# EAGLE design Driver (EAGLE 9.6.2)
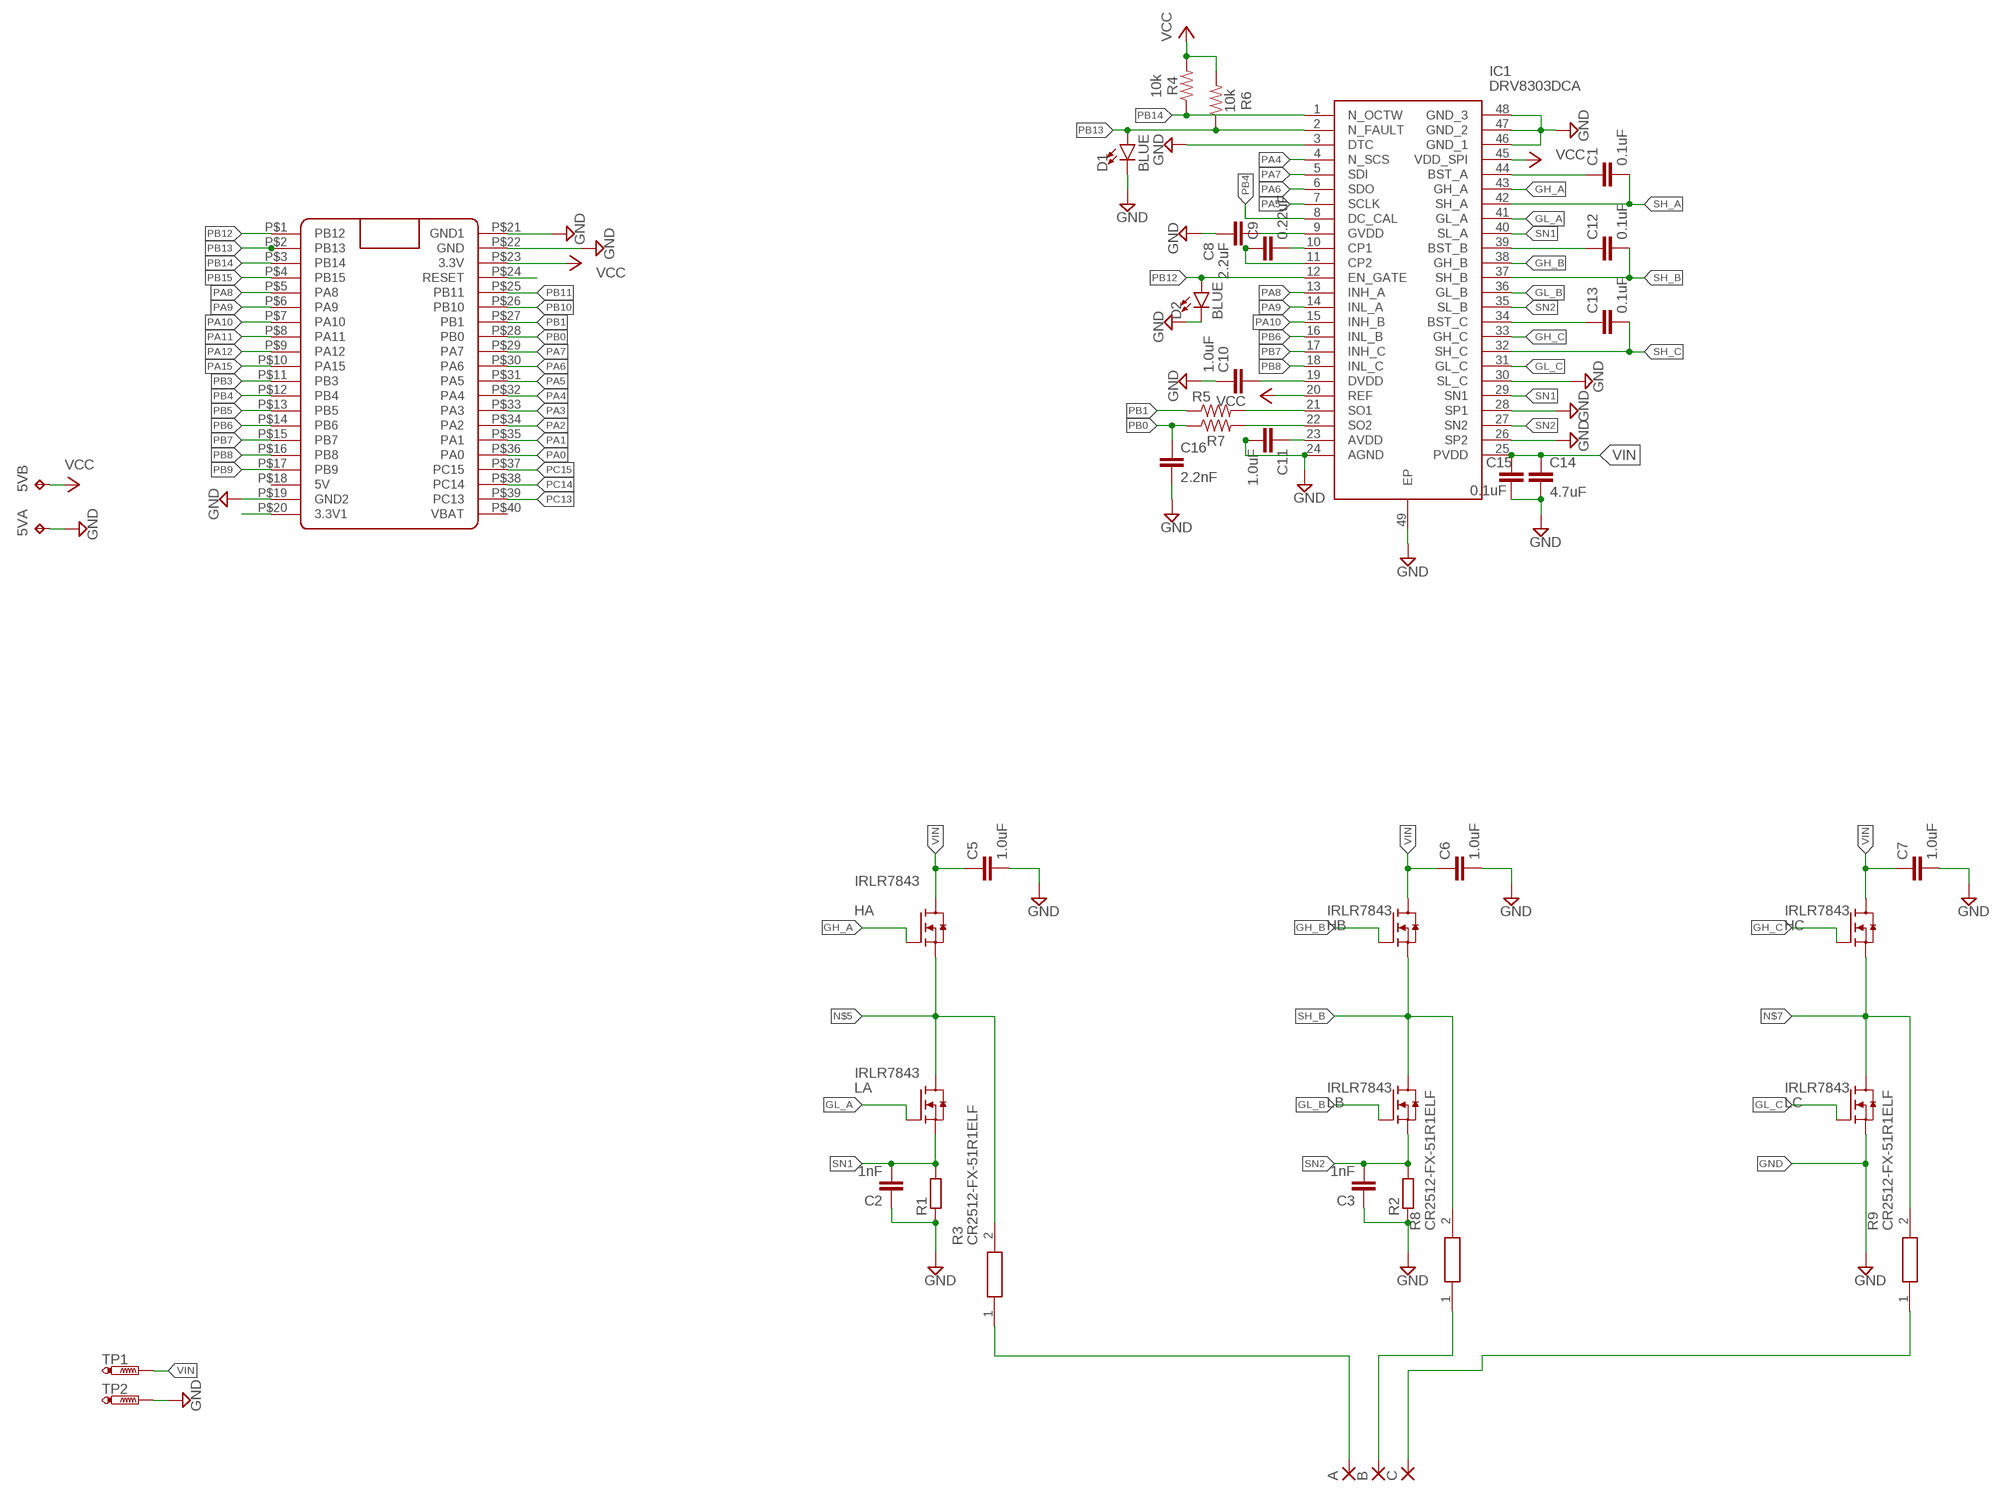
[diagram p0: schematic, sheet 1]

## Parts
5V  TP2P2-38-17  [P2-38-17]
A  SMD5  [SMD2,54-5,08]
B  SMD5  [SMD2,54-5,08]
C  SMD5  [SMD2,54-5,08]
C1  0.1uF  0.1UF-0603-25V-(+80/-20%)  [0603]
C2  1nF  1.0NF/1000PF-0603-50V-10%  [0603]
C3  1nF  1.0NF/1000PF-0603-50V-10%  [0603]
C5  1.0uF  1.0UF-0603-16V-10%-X7R  [0603]
C6  1.0uF  1.0UF-0603-16V-10%-X7R  [0603]
C7  1.0uF  1.0UF-0603-16V-10%-X7R  [0603]
C8  2.2uF  2.2UF-0603-10V-20%  [0603]
C9  0.22uF  0.22UF-0603-25V-10%  [0603]
C10  1.0uF  1.0UF-0603-16V-10%  [0603]
C11  1.0uF  1.0UF-0603-16V-10%  [0603]
C12  0.1uF  0.1UF-0603-25V-(+80/-20%)  [0603]
C13  0.1uF  0.1UF-0603-25V-(+80/-20%)  [0603]
C14  4.7uF  4.7UF-0603-35V-(20%)  [0603]
C15  0.1uF  0.1UF-0603-25V-(+80/-20%)  [0603]
C16  2.2nF  2.2NF/2200PF-0603-50V-10%  [0603]
D1  BLUE  LED-BLUE0603  [LED-0603]
D2  BLUE  LED-BLUE0603  [LED-0603]
HA  IRLR7843  [TO252]
HB  IRLR7843  [TO252]
HC  IRLR7843  [TO252]
IC1  DRV8303DCA  [SOP50P810X120-49N]
LA  IRLR7843  [TO252]
LB  IRLR7843  [TO252]
LC  IRLR7843  [TO252]
R1  R-EU_R2512  [R2512]
R2  R-EU_R2512  [R2512]
R3  CR2512-FX-51R1ELF  [RESC6331X75N]
R4  10k  10KOHM-0603-1/10W-1%  [0603]
R5  0  0OHM-0603-1/10W  [0603]
R6  10k  10KOHM-0603-1/10W-1%  [0603]
R7  0  0OHM-0603-1/10W  [0603]
R8  CR2512-FX-51R1ELF  [RESC6331X75N]
R9  CR2512-FX-51R1ELF  [RESC6331X75N]
TP1  PTR1PAD1-20Y  [P1-20Y]
TP2  PTR1PAD1-20Y  [P1-20Y]
U$1  BLUE_PILLADVANCED  [BLUE_PILL_ADV]

## Nets
GH_A: HA.1(G) IC1.43(GH_A)
GH_B: HB.1(G) IC1.38(GH_B)
GH_C: HC.1(G) IC1.33(GH_C)
GL_A: IC1.41(GL_A) LA.1(G)
GL_B: IC1.36(GL_B) LB.1(G)
GL_C: IC1.31(GL_C) LC.1(G)
GND: 5V.TP-1 C2.1 C3.1 C5.2 C6.2 C7.2 C8.2 C10.1 C11.2 C14.2 C15.2 C16.2 D1.C D2.C IC1.3(DTC) IC1.24(AGND) IC1.26(SP2) IC1.28(SP1) IC1.30(SL_C) IC1.46(GND_1) IC1.47(GND_2) IC1.48(GND_3) IC1.49(EP) LC.2(S) R1.1 R2.1 TP2.TP U$1.P$19(GND2) U$1.P$21(GND1) U$1.P$22(GND)
N$1: IC1.21(SO1) R5.2
N$2: C1.1 IC1.44(BST_A)
N$3: IC1.22(SO2) R7.2
N$4: U$1.P$24(RESET)
N$5: HA.2(S) LA.3(D) R3.2
N$6: B.1(P) R8.1
N$7: HC.2(S) LC.3(D) R9.2
N$9: C12.1 IC1.39(BST_B)
N$14: C13.1 IC1.34(BST_C)
N$32: C8.1 IC1.9(GVDD)
N$33: C9.2 IC1.10(CP1)
N$34: C9.1 IC1.11(CP2)
N$40: U$1.P$20(3.3V1)
N$43: C10.2 IC1.19(DVDD)
N$47: C11.1 IC1.23(AVDD)
PA0: U$1.P$36(PA0)
PA1: U$1.P$35(PA1)
PA2: U$1.P$34(PA2)
PA3: U$1.P$33(PA3)
PA4: IC1.4(N_SCS) U$1.P$32(PA4)
PA5: IC1.7(SCLK) U$1.P$31(PA5)
PA6: IC1.6(SDO) U$1.P$30(PA6)
PA7: IC1.5(SDI) U$1.P$29(PA7)
PA8: IC1.13(INH_A) U$1.P$5(PA8)
PA9: IC1.14(INL_A) U$1.P$6(PA9)
PA10: IC1.15(INH_B) U$1.P$7(PA10)
PA11: U$1.P$8(PA11)
PA12: U$1.P$9(PA12)
PA15: U$1.P$10(PA15)
PB0: C16.1 R7.1 U$1.P$28(PB0)
PB1: R5.1 U$1.P$27(PB1)
PB3: U$1.P$11(PB3)
PB4: IC1.8(DC_CAL) U$1.P$12(PB4)
PB5: U$1.P$13(PB5)
PB6: IC1.16(INL_B) U$1.P$14(PB6)
PB7: IC1.17(INH_C) U$1.P$15(PB7)
PB8: IC1.18(INL_C) U$1.P$16(PB8)
PB9: U$1.P$17(PB9)
PB10: U$1.P$26(PB10)
PB11: U$1.P$25(PB11)
PB12: D2.A IC1.12(EN_GATE) U$1.P$1(PB12)
PB13: D1.A IC1.2(N_FAULT) R6.1 U$1.P$2(PB13)
PB14: IC1.1(N_OCTW) R4.1 U$1.P$3(PB14)
PB15: U$1.P$4(PB15)
PC13: U$1.P$39(PC13)
PC14: U$1.P$38(PC14)
PC15: U$1.P$37(PC15)
SH_A: A.1(P) C1.2 IC1.42(SH_A) R3.1
SH_B: C12.2 HB.2(S) IC1.37(SH_B) LB.3(D) R8.2
SH_C: C13.2 C.1(P) IC1.32(SH_C) R9.1
SN1: C2.2 IC1.29(SN1) IC1.40(SL_A) LA.2(S) R1.2
SN2: C3.2 IC1.27(SN2) IC1.35(SL_B) LB.2(S) R2.2
VCC: 5V.TP-2 IC1.20(REF) IC1.45(VDD_SPI) R4.2 R6.2 U$1.P$23(3.3V)
VIN: C5.1 C6.1 C7.1 C14.1 C15.1 HA.3(D) HB.3(D) HC.3(D) IC1.25(PVDD) TP1.TP
Unconnected: U$1.P$18(5V) U$1.P$40(VBAT)

## Library data of the parts
5V = testpad:TP2: Test pad
A B C = wirepad:SMD5: SMD PAD
C1 C12 C13 C15 = SparkFun-Capacitors:0.1UF: 0.1µF ceramic capacitors A capacitor is a passive two-terminal electrical component used to store electrical energy temporarily in an electric field.; PROD_ID: CAP-00810
C2 C3 = SparkFun-Capacitors:1.0NF/1000PF: 1nF/1,000pF ceramic capacitors A capacitor is a passive two-terminal electrical component used to store electrical energy temporarily in an electric field.; PROD_ID: CAP-07886
C5-C7 = SparkFun-Capacitors:1.0UF: 1µF ceramic capacitors A capacitor is a passive two-terminal electrical component used to store electrical energy temporarily in an electric field.; PROD_ID: CAP-13930
C8 = SparkFun-Capacitors:2.2UF: 2.2µF ceramic capacitors A capacitor is a passive two-terminal electrical component used to store electrical energy temporarily in an electric field.; PROD_ID: CAP-07888
C9 = SparkFun-Capacitors:0.22UF: 0.22µF ceramic capacitors A capacitor is a passive two-terminal electrical component used to store electrical energy temporarily in an electric field.; PROD_ID: CAP-07822
C10 C11 = SparkFun-Capacitors:1.0UF: 1µF ceramic capacitors A capacitor is a passive two-terminal electrical component used to store electrical energy temporarily in an electric field.; PROD_ID: CAP-00868
C14 = SparkFun-Capacitors:4.7UF: 4.7µF ceramic capacitors A capacitor is a passive two-terminal electrical component used to store electrical energy temporarily in an electric field.; PROD_ID: CAP-14106
C16 = SparkFun-Capacitors:2.2NF/2200PF: 2.2nF/2,200pF ceramic capacitors A capacitor is a passive two-terminal electrical component used to store electrical energy temporarily in an electric field.; PROD_ID: CAP-07877
D1 D2 = SparkFun-LED:LED-BLUE: Blue SMD LED Used in manufacturing of various products at SparkFun Packages: 0603 - SMD 0603 package [Product Link] <http://www.digikey.com/product-detail/en/SMLE12BC7TT86/511-1589-2-ND/1641808> 1206 - SMD1206 package [Product Link] <http://www.digikey.com/product-detail/en/lite-on-inc/LTST-C150TBKT/160-1643-1-ND/573584> SparkFun Products: ESP8266 Thing-Dev Board <https://www.sparkfun.com/products/13711> RedBoard <https://www.sparkfun.com/products/12757>; PROD_ID: DIO-08575
HA HB HC LA LB LC = BLDC project:IRLR7843
IC1 = DRV8303DCA:DRV8303DCA: Texas Instruments DRV8303DCA, Three-Phase Gate Driver With Dual-Current Shunt Source: Datasheet <https://componentsearchengine.com/Datasheets/2/DRV8303DCA.pdf>; ARROW_PART_NUMBER: DRV8303DCA; ARROW_PRICE-STOCK: https://www.arrow.com/en/products/drv8303dca/texas-instruments; DESCRIPTION: Texas Instruments DRV8303DCA, Three-Phase Gate Driver With Dual-Current Shunt; HEIGHT: 1.2mm; MANUFACTURER_NAME: Texas Instruments; MANUFACTURER_PART_NUMBER: DRV8303DCA; MOUSER_PART_NUMBER: 595-DRV8303DCA; MOUSER_PRICE-STOCK: https://www.mouser.co.uk/ProductDetail/Texas-Instruments/DRV8303DCA?qs=igp4D3uu33KLowzNFy6WPA%3D%3D
R1 R2 = rcl:R-EU_: RESISTOR, European symbol; SPICEPREFIX: R
R3 R8 R9 = CR2512-FX-51R1ELF:CR2512-FX-51R1ELF: BOURNS - CR2512-FX-51R1ELF - RES 2512 51R1 1% 1W TC100 28X7511 Source: Datasheet <http://componentsearchengine.com/Datasheets/2/CR2512-FX-51R1ELF.pdf>; ARROW_PART_NUMBER: CR2512-FX-51R1ELF; ARROW_PRICE-STOCK: https://www.arrow.com/en/products/cr2512-fx-51r1elf/bourns; DESCRIPTION: BOURNS - CR2512-FX-51R1ELF - RES 2512 51R1 1% 1W TC100 28X7511; HEIGHT: 0.75mm; MANUFACTURER_NAME: Bourns; MANUFACTURER_PART_NUMBER: CR2512-FX-51R1ELF; MOUSER_PART_NUMBER: 652-CR2512FX51R1ELF; MOUSER_PRICE-STOCK: https://www.mouser.com/Search/Refine.aspx?Keyword=652-CR2512FX51R1ELF
R4 R6 = SparkFun-Resistors:10KOHM: 10kΩ resistor A resistor is a passive two-terminal electrical component that implements electrical resistance as a circuit element. Resistors act to reduce current flow, and, at the same time, act to lower voltage levels within circuits. - Wikipedia; PROD_ID: RES-00824
R5 R7 = SparkFun-Resistors:0OHM: 0Ω resistor A resistor is a passive two-terminal electrical component that implements electrical resistance as a circuit element. Resistors act to reduce current flow, and, at the same time, act to lower voltage levels within circuits. - Wikipedia; PROD_ID: RES-08609
TP1 TP2 = testpad:PTR1: TEST PIN
U$1 = BluePill:BLUE_PILL

## Board
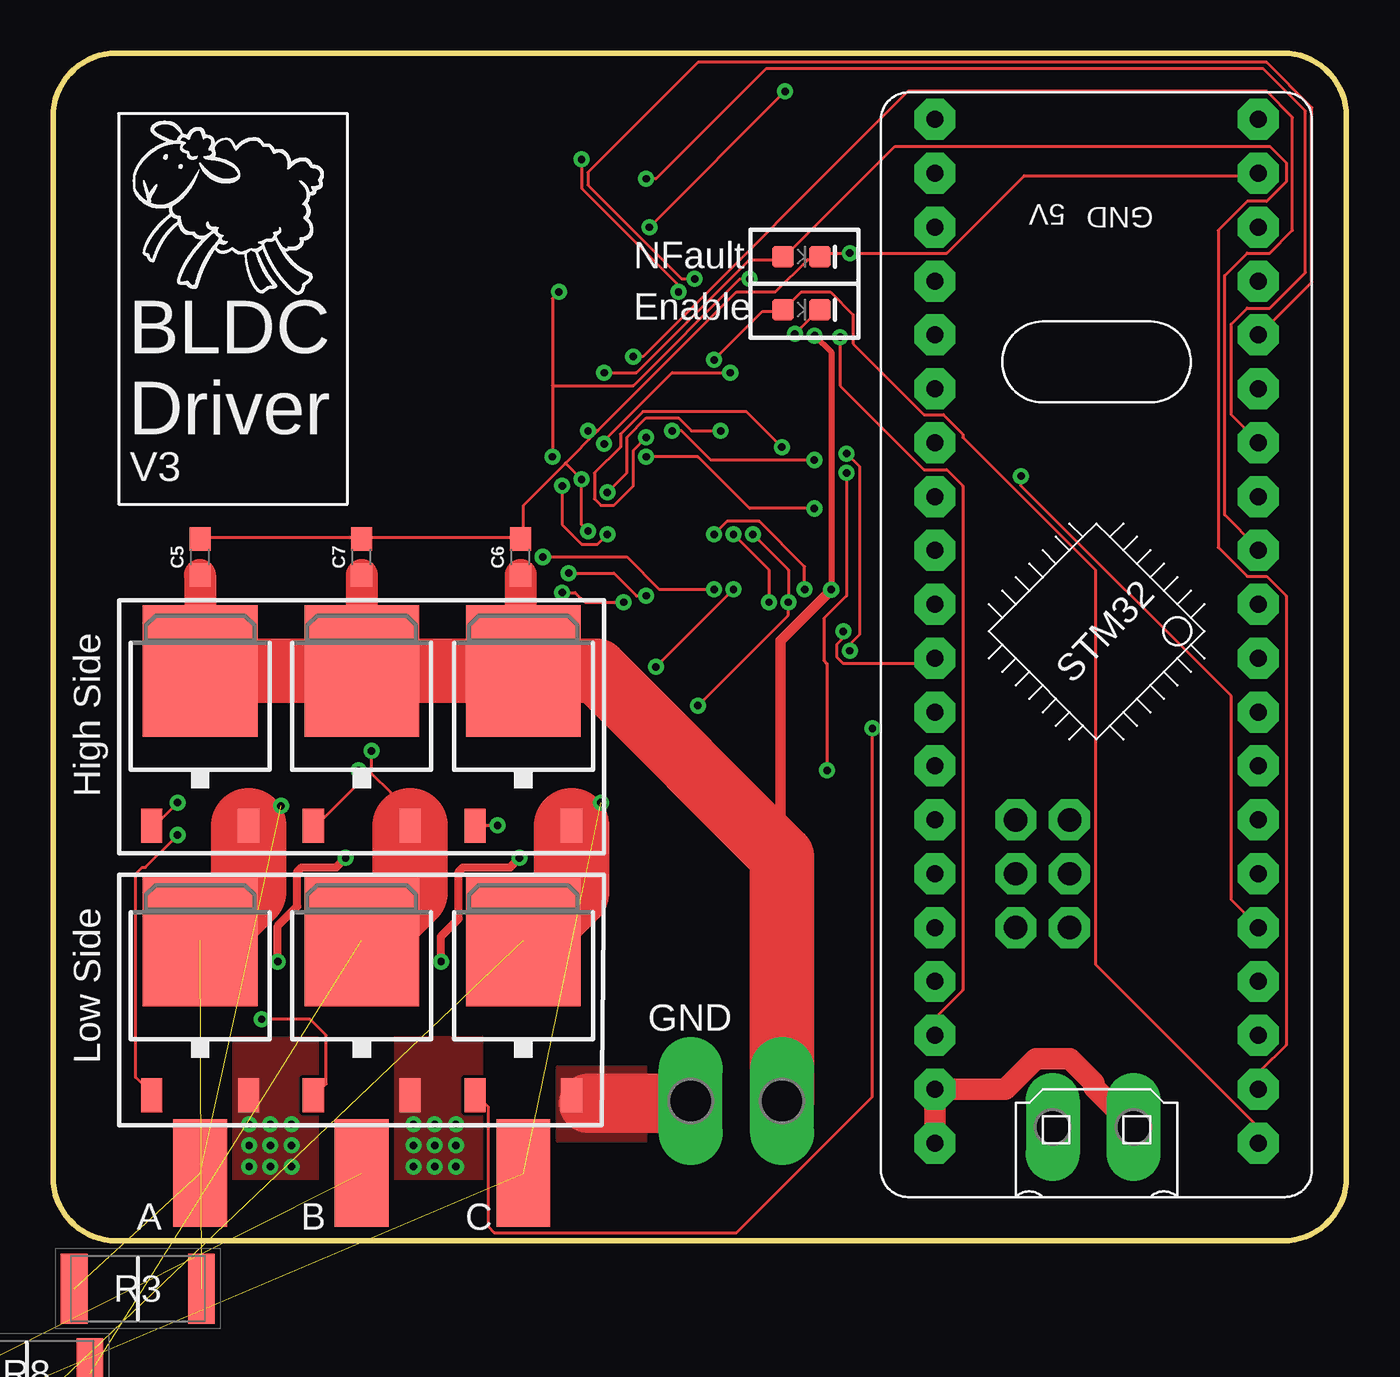
[diagram p1: board, top side]
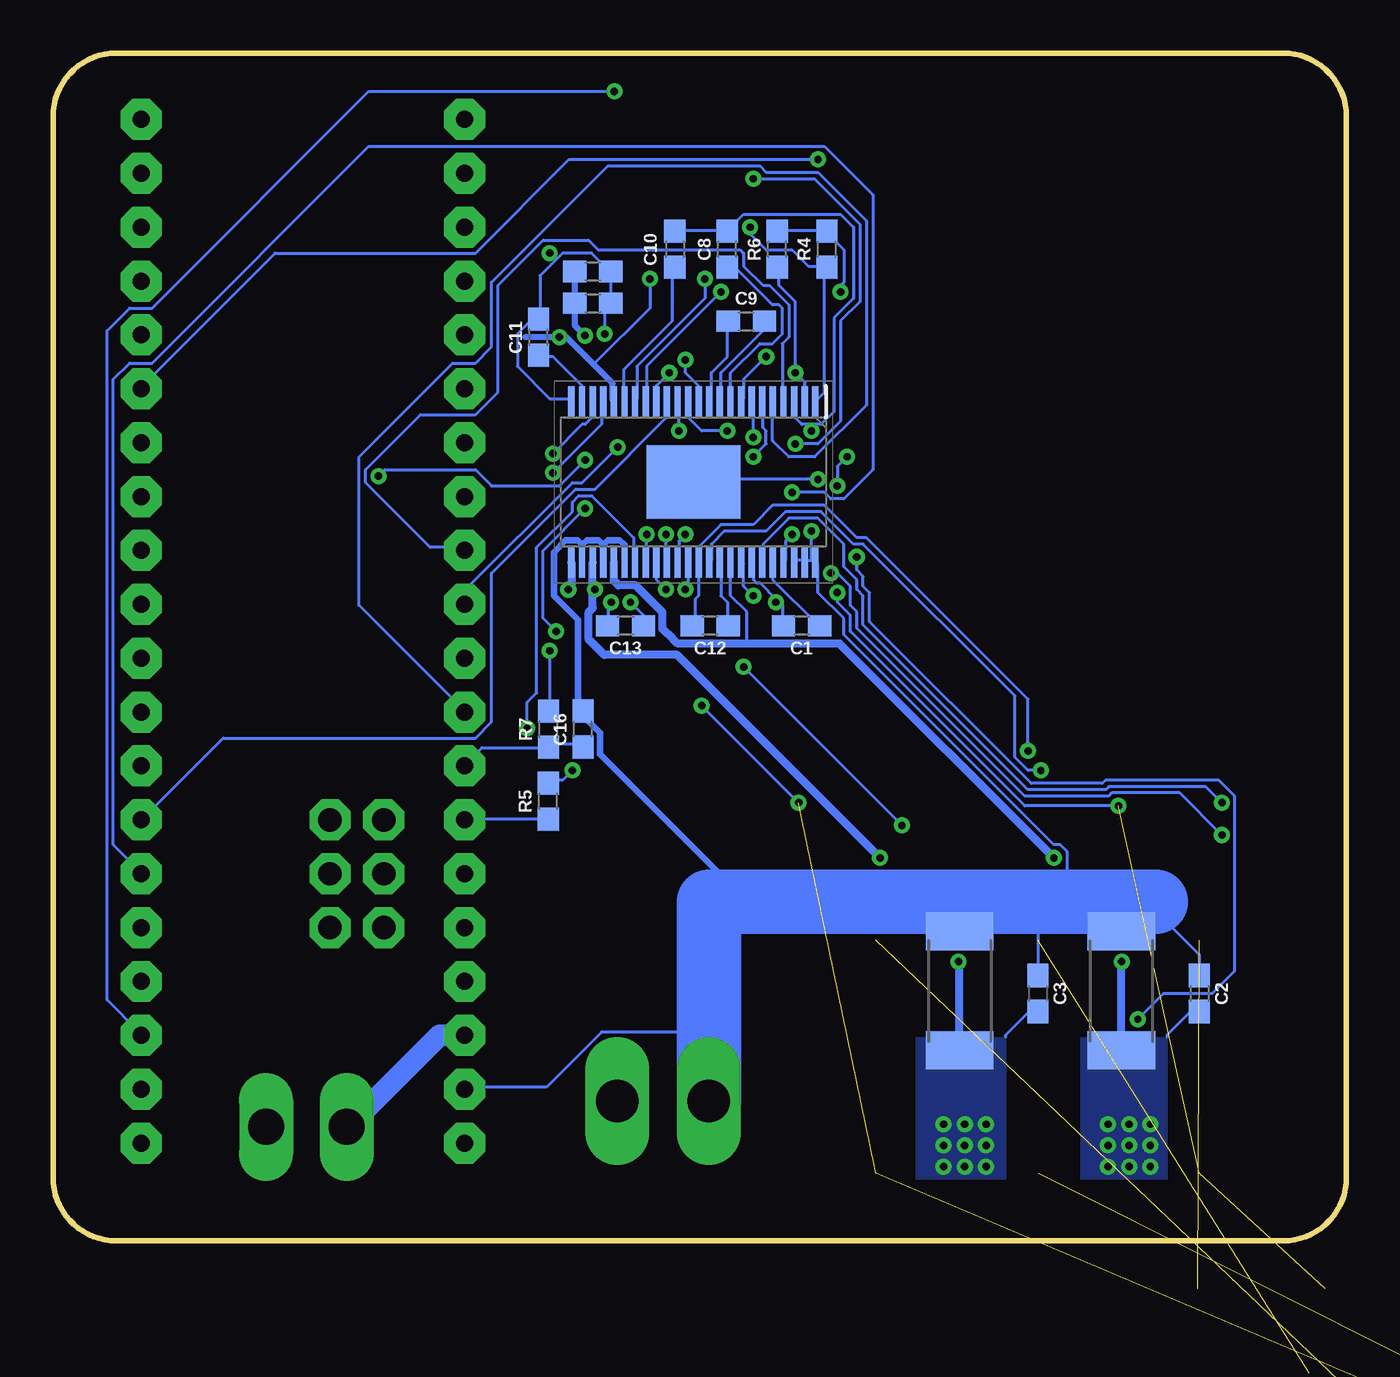
[diagram p2: board, bottom side, seen from below]

Size 61 x 56 mm. Coordinates in mm from the lower left corner, seen from the top.
Outline: 61,3 61,53 arc90 58,56 3,56 arc90 0,53 0,3 arc90 3,0 58,0 arc90 61,3
Copper layers (1*16): Top 0.035mm / dielectric 1.5mm / Bottom 0.035mm
Design rules "default *": minimum track width 6mil, minimum drill 0.35mm, track to track 6mil, track to pad 6mil, pad to pad 6mil, via to via 6mil, smd to smd 6mil, copper to edge 6mil, drill to drill 6mil, minimum pad ring 10mil, minimum via ring 8mil, stop-mask expansion 4mil, vias tented up to drill 3mm, thermal gap 0mil

### Footprints (pad centres in the part's own frame; a part is rotated, then mirrored left to right if it is on the bottom)
P2-38-17 = drill 1.702 pad 2.121 long: TP-1 -1.905,0; TP-2 1.905,0
SMD2,54-5,08 = smd 2.54 x 5.08: 1 0,0
0603 = smd 1.1 x 1: 1 -0.85,0; 2 0.85,0
LED-0603 = smd 1 x 1: A -0.877,0; C 0.877,0
TO252 = smd 1 x 1.6: 1 -2.28,-4.8; 2 2.28,-4.8 | smd 5.4 x 6.2: 3 0,2.5
SOP50P810X120-49N = smd 1.475 x 0.3: 1 -3.788,5.75; 2 -3.788,5.25; 3 -3.788,4.75; 4 -3.788,4.25; 5 -3.788,3.75; 6 -3.788,3.25; 7 -3.788,2.75; 8 -3.788,2.25; 9 -3.788,1.75; 10 -3.788,1.25; 11 -3.788,0.75; 12 -3.788,0.25; 13 -3.788,-0.25; 14 -3.788,-0.75; 15 -3.788,-1.25; 16 -3.788,-1.75; 17 -3.788,-2.25; 18 -3.788,-2.75; 19 -3.788,-3.25; 20 -3.788,-3.75; 21 -3.788,-4.25; 22 -3.788,-4.75; 23 -3.788,-5.25; 24 -3.788,-5.75; 25 3.788,-5.75; 26 3.788,-5.25; 27 3.788,-4.75; 28 3.788,-4.25; 29 3.788,-3.75; 30 3.788,-3.25; 31 3.788,-2.75; 32 3.788,-2.25; 33 3.788,-1.75; 34 3.788,-1.25; 35 3.788,-0.75; 36 3.788,-0.25; 37 3.788,0.25; 38 3.788,0.75; 39 3.788,1.25; 40 3.788,1.75; 41 3.788,2.25; 42 3.788,2.75; 43 3.788,3.25; 44 3.788,3.75; 45 3.788,4.25; 46 3.788,4.75; 47 3.788,5.25; 48 3.788,5.75 | smd 3.48 x 4.42: 49 0,0
R2512 = smd 1.8 x 3.2: 1 -2.8,0; 2 2.8,0
RESC6331X75N = smd 1.25 x 3.3: 1 -3,0; 2 3,0
P1-20Y = drill 2.007 pad 2.54 long: TP 0,0
BLUE_PILL_ADV = drill 0.8 pad 1.93 octagon: P$1 10.16,-30.48; P$2 10.16,-27.94; P$3 10.16,-25.4; P$4 10.16,-22.86; P$5 10.16,-20.32; P$6 10.16,-17.78; P$7 10.16,-15.24; P$8 10.16,-12.7; P$9 10.16,-10.16; P$10 10.16,-7.62; P$11 10.16,-5.08; P$12 10.16,-2.54; P$13 10.16,0; P$14 10.16,2.54; P$15 10.16,5.08; P$16 10.16,7.62; P$17 10.16,10.16; P$18 10.16,12.7; P$19 10.16,15.24; P$20 10.16,17.78; P$21 -5.08,-30.48; P$22 -5.08,-27.94; P$23 -5.08,-25.4; P$24 -5.08,-22.86; P$25 -5.08,-20.32; P$26 -5.08,-17.78; P$27 -5.08,-15.24; P$28 -5.08,-12.7; P$29 -5.08,-10.16; P$30 -5.08,-7.62; P$31 -5.08,-5.08; P$32 -5.08,-2.54; P$33 -5.08,0; P$34 -5.08,2.54; P$35 -5.08,5.08; P$36 -5.08,7.62; P$37 -5.08,10.16; P$38 -5.08,12.7; P$39 -5.08,15.24; P$40 -5.08,17.78 | drill 1.1 pad 1.93 octagon: P$42 -1.27,-20.32; P$43 -1.27,-17.78; P$44 -1.27,-15.24; P$45 1.27,-15.24; P$46 1.27,-17.78; P$47 1.27,-20.32

### Placement (x,y rotation side)
5V  49.05,5.37 180 top
A  6.94,3.2 0 top
B  14.56,3.2 0 top
C  22.18,3.2 0 top
C1  25.7,29 180 bottom
C2  6.94,11.67 270 bottom
C3  14.56,11.67 270 bottom
C5  6.94,32.24 90 top
C6  22.05,32.24 90 top
C7  14.56,32.24 90 top
C8  29.2,46.75 90 bottom
C9  28.3,43.35 0 bottom
C10  31.68,46.75 270 bottom
C11  38.1,42.6 90 bottom
C12  30,29 180 bottom
C13  34,29 180 bottom
C14  35.55,44.2 0 bottom
C15  35.55,45.7 0 bottom
C16  36,24.13 90 bottom
D1  35.3,46.4 0 top
D2  35.3,43.9 0 top
HA  6.94,24.37 0 top
HB  14.56,24.37 0 top
HC  22.18,24.37 0 top
IC1  30.8,35.78 270 bottom
LA  6.94,11.67 0 top
LB  14.56,11.67 0 top
LC  22.18,11.67 0 top
R1  10.62,11.79 270 bottom
R2  18.24,11.79 270 bottom
R3  4,-2.25 0 top
R4  24.5,46.75 90 bottom
R5  37.64,20.73 90 bottom
R6  26.85,46.75 90 bottom
R7  37.63,24.12 90 bottom
R8  -1.25,-6.25 0 top  (outside the outline)
R9  -6.5,-10.25 0 top  (outside the outline)
TP1  34.38,6.59 0 top
TP2  30.07,6.59 0 top
U$1  46.67,35.09 0 top

### Tracks (layer width: path | path; a pad name or v marks a point on that pad's centre or on a via)
GH_A  (via drill 0.35)
  Top 0.152: v5.88,20.66 4.81,19.59 HA.1
  Bottom 0.152: v5.88,20.66 6.64,21.42 11.21,21.42 11.36,21.27 15.02,21.27 22.79,29.04 22.79,30.41 23.1,30.72 23.1,31.18 23.71,31.79 23.71,32.85 24.93,34.07 26.3,34.07 27.52,32.85 27.52,32.09 IC1.43
GH_B  (via drill 0.35)
  Top 0.152: v14.41,22.18 14.41,21.57 12.43,19.59 HB.1
  Bottom 0.152: v14.41,22.18 15.02,22.18 15.63,22.79 15.63,25.69 22.79,32.85 23.25,32.85 24.77,34.38 26.45,34.38 27.36,33.46 29.35,33.46 29.96,32.85 29.96,32.09 IC1.38
GH_C  (via drill 0.35)
  Top 0.152: v28.43,27.06 v32.09,30.72 | v20.96,19.59 20.05,19.59 HC.1
  Bottom 0.152: v32.09,30.72 32.55,31.18 32.55,31.94 IC1.33 | v20.96,19.59 v28.43,27.06
GL_A  (via drill 0.35)
  Top 0.152: v27.98,30.41 27.52,30.41 26.45,31.48 v24.32,31.48 | v5.88,19.14 4.35,17.61 4.2,17.61 3.9,17.31 3.9,7.71 4.66,6.94 LA.1
  Bottom 0.152: v27.98,30.41 28.43,30.87 28.43,31.94 IC1.41 | v24.32,31.48 24.01,31.48 23.4,30.87 23.4,29.96 23.1,29.65 23.1,28.89 15.17,20.96 11.21,20.96 11.06,21.12 7.86,21.12 v5.88,19.14
GL_B  (via drill 0.35)
  Top 0.152: v31.18,30.72 28.58,30.72 27.06,32.24 v23.1,32.24 | v9.84,10.45 12.12,10.45 12.89,9.69 12.89,7.4 12.43,6.94 LB.1
  Bottom 0.152: v31.18,30.72 31.02,30.87 31.02,31.94 IC1.36 | v23.1,32.24 23.1,31.63 22.79,31.33 22.79,30.87 22.49,30.57 22.49,29.19 14.87,21.57 11.52,21.57 11.36,21.73 6.03,21.73 5.27,20.96 5.27,12.73 6.33,11.67 8.62,11.67 v9.84,10.45
GL_C  (via drill 0.35)
  Top 0.152: v38.64,24.16 38.64,6.79 32.24,0.39 20.81,0.39 20.51,0.7 20.51,6.33 20.05,6.79 LC.1
  Bottom 0.152: v38.64,24.16 38.64,25.38 38.19,25.84 38.19,32.7 36.51,34.38 36.51,34.83 36.2,35.14 35.59,35.14 33.61,33.16 33.61,32.09 IC1.31
GND  (via drill 0.35)
  Top 0.152: v34.98,42.76 36.05,43.82 D2.C | C5.2 6.94,33.16 14.41,33.16 C7.2 14.56,33.16 22.03,33.16 C6.2 22.18,33.16 22.18,34.68 24.16,36.66 | 24.16,36.66 25.69,38.19 | 25.69,38.19 32.24,44.74 34.07,44.74 35.59,46.26 36.05,46.26 D1.C 36.2,46.41 36.36,46.57 v37.58,46.57 42.15,46.57 45.81,50.23 56.78,50.23 U$1.P$19 | 24.16,36.66 v24.93,35.9 24.93,33.77 v25.23,33.46 | 25.69,38.19 v25.23,38.19 | 41.69,4.66 U$1.P$21 | 41.69,7.1 U$1.P$22 41.69,7.25 | 50.84,5.42 5V.TP-1
  Top 1.016: 5V.TP-1 49.08,7.25 49.08,7.45 47.95,8.59 46.34,8.59 44.91,7.15 U$1.P$22 U$1.P$21
  Top 2.794: TP2.TP 29.98,6.5 25.25,6.5
  Bottom 0.152: C10.1 31.63,47.63 29.35,47.63 C8.2 29.19,47.63 28.43,48.4 23.86,48.4 23.25,47.79 23.25,44.43 24.16,43.52 24.16,39.1 24.77,38.49 25.23,38.49 | 25.23,38.49 25.69,38.49 25.99,38.8 25.99,39.56 IC1.3 | v34.98,42.76 34.98,43.98 34.83,44.13 C14.2 34.68,44.28 34.68,45.65 C15.2 34.83,45.81 35.59,46.57 36.97,46.57 37.27,46.26 | 37.27,46.26 38.03,45.5 38.03,43.52 C11.2 38.19,43.37 38.49,43.37 39.1,42.76 39.1,41.23 37.58,39.71 36.66,39.71 IC1.24 | v24.93,35.9 30.72,35.9 IC1.49 | v37.58,46.57 37.27,46.26 | v25.23,38.19 25.23,38.49 | 25.23,32.09 25.54,32.09 IC1.47 25.69,32.09 25.99,32.09 IC1.46 | 25.23,32.09 25.08,32.09 IC1.48 24.93,31.94 24.93,30.57 23.71,29.35 23.71,28.58 13.8,18.68 13.5,18.68 13.19,18.37 13.19,16 | C2.1 6.94,12.58 6.94,13.5 8.16,14.72 9,16 | 14.56,16 14.56,12.58 C3.1 | C16.2 36.05,24.93 36.11,24.87 | 30.07,9.84 35.14,9.84 37.73,7.25 41.54,7.25 U$1.P$22 | 25.23,32.09 v25.23,33.46
  Bottom 0.3: IC1.30 34.06,32.81 34.27,33.03 34.83,33.03 35.04,32.81 IC1.28 35.06,32.81 35.27,33.03 35.83,33.03 36.04,32.81 IC1.26 36.06,32.81 36.27,33.03 36.83,33.03 37.38,32.47 37.38,30.42 36.24,29.27 36.24,24.99 36.11,24.87 35.2,23.95 35.2,22.95 28.25,16
  Bottom 1.27: R1.1 10.62,16 10.5,16 | R2.1 18.24,16 18,16
  Bottom 3.048: TP2.TP 30.07,9.84 30.07,16 28.25,16 18,16 14.56,16 13.19,16 10.5,16 9,16
  pour Top: 23.75,8.2 23.75,4.7 28,4.7 28,8.2
N$1  (via drill 0.35)
  Top 0.152: v36.51,22.18 36.51,27.21 36.36,27.36 36.36,29.35 37.42,30.41 v37.42,36.2
  Bottom 0.152: v36.51,22.18 36.97,21.73 37.58,21.73 R5.2 | v37.42,36.2 35.14,38.49 35.14,39.56 IC1.21
N$2
  Bottom 0.152: C1.1 24.93,29.04 27.06,31.18 27.06,31.94 IC1.44
N$3  (via drill 0.35)
  Top 0.152: v37.58,27.82 37.58,28.13 38.03,28.58 38.03,36.51 v37.42,37.12
  Bottom 0.152: v37.58,27.82 37.58,25.08 R7.2 | v37.42,37.12 36.05,38.49 35.9,38.49 35.59,38.8 35.59,39.56 IC1.22
N$5  (1 unrouted)
  Top 3.556: HA.2 9.22,16.47 6.5,13.75 6.52,13.75 LA.3
N$6  (1 unrouted)
N$7  (1 unrouted)
  Top 3.556: HC.2 24.46,16.45 LC.3
N$9
  Bottom 0.152: C12.1 29.19,29.04 29.19,30.11 29.5,30.41 29.5,31.94 IC1.39
N$14  (via drill 0.35)
  Top 0.152: v33.77,30.11 33.77,31.63 v32.09,33.31
  Bottom 0.152: v33.77,30.11 33.16,29.5 33.16,29.04 C13.1 | v32.09,33.31 32.09,32.09 IC1.34
N$32
  Bottom 0.152: C8.1 29.19,45.81 28.74,45.81 27.06,44.13 26.76,44.13 26.6,43.98 26.6,42.76 27.06,42.3 27.67,42.3 29.04,40.93 29.04,39.71 IC1.9
N$33
  Bottom 0.152: C9.2 27.52,43.22 27.52,42.91 29.5,40.93 29.5,39.71 IC1.10
N$34
  Bottom 0.152: C9.1 29.19,43.22 29.19,41.69 29.96,40.93 29.96,39.71 IC1.11
N$43
  Bottom 0.152: C10.2 31.79,45.81 31.79,43.37 34.07,41.08 34.07,39.59 IC1.19
N$47
  Bottom 0.152: C11.1 38.03,41.69 37.42,41.69 36.05,40.32 36.05,39.71 IC1.23
PA4
  Bottom 0.152: IC1.4 26.6,39.71 26.6,42.3 26.3,42.6 26.3,44.13 27.21,45.04 27.52,45.04 28.43,45.96 28.43,46.57 28.58,46.72 35.29,46.72 35.75,47.18 37.88,47.18 40.01,45.04 40.01,40.01 41.08,38.95 43.67,38.95 46.26,36.36 46.26,35.75 43.22,32.7 41.69,32.7 U$1.P$32
PA5  (via drill 0.35)
  Top 0.152: v27.98,37.88 27.36,37.27 27.36,35.59 26.45,34.68 25.84,34.68 25.54,34.98 25.54,36.2 26.76,37.42 26.76,38.03 27.82,39.1 32.7,39.1 v34.38,37.42
  Bottom 0.152: v27.98,37.88 27.98,39.56 IC1.7 | v34.38,37.42 36.05,35.75 36.51,35.75 41.54,30.72 41.54,30.11 U$1.P$31
PA6  (via drill 0.35)
  Top 0.152: v27.98,36.97 30.41,36.97 32.85,34.53 v35.9,34.53 | v37.27,28.74 37.27,28.43 36.97,28.13 36.97,27.52 37.27,27.21 41.39,27.21 41.54,27.36 U$1.P$30
  Bottom 0.152: v27.98,36.97 27.36,37.58 27.36,38.19 27.52,38.34 27.52,39.56 IC1.6 | v35.9,34.53 37.88,32.55 37.88,29.35 v37.27,28.74
PA7
  Bottom 0.152: IC1.5 27.06,37.73 26.3,36.97 25.08,36.97 22.64,39.41 22.64,48.09 24.93,50.38 27.36,50.38 27.67,50.68 34.83,50.68 40.32,45.2 40.32,42.15 41.08,41.39 42.15,41.39 46.57,36.97 46.57,29.96 41.69,25.08 U$1.P$29
PA8  (via drill 0.35)
  Top 0.152: v29.19,38.19 29.65,38.19 31.02,36.81 v35.9,36.81 | v45.65,36.05 45.65,35.59 55.56,25.69 55.56,16.09 56.78,14.87 U$1.P$5
  Bottom 0.152: v29.19,38.19 30.41,38.19 31.02,38.8 31.02,39.56 IC1.13 | v35.9,36.81 37.12,35.59 40.32,35.59 41.08,36.36 45.35,36.36 v45.65,36.05
PA9  (via drill 0.35)
  Top 0.152: v31.48,38.19 30.11,38.19 29.5,38.8 27.98,38.8 27.06,37.88 27.06,36.2 v26.15,35.29
  Bottom 0.152: v31.48,38.19 31.48,39.56 IC1.14 | v26.15,35.29 24.62,35.29 24.32,34.98 23.71,34.98 22.34,36.36 22.34,49.31 24.62,51.6 46.11,51.6 56.32,41.39 57.39,41.39 58.15,40.62 58.15,18.68 56.93,17.46 U$1.P$6
PA10
  Bottom 0.152: IC1.15 32.09,39.56 32.09,38.8 35.44,35.44 36.36,35.44 40.32,31.48 40.32,24.47 41.08,23.71 52.97,23.71 56.78,19.9 U$1.P$7
PB0
  Bottom 0.152: C16.1 36.05,23.4 37.58,23.4 R7.1 37.73,23.25 40.78,23.25 41.54,22.49 U$1.P$28
PB1
  Bottom 0.152: R5.1 37.73,19.9 41.54,19.9 U$1.P$27
PB4  (via drill 0.35)
  Top 0.152: v27.36,41.69 27.82,41.69 40.32,54.19 57.24,54.19 58.45,52.97 58.45,47.63 57.39,46.57 56.32,46.57 55.25,45.5 55.25,34.22 56.78,32.7 U$1.P$12
  Bottom 0.152: v27.36,41.69 28.43,40.62 28.43,39.71 IC1.8
PB6  (via drill 0.35)
  Top 0.152: v31.94,40.93 29.19,40.93 25.99,37.73 v25.99,37.58 | v27.98,50.07 28.43,50.07 33.61,55.25 57.08,55.25 59.06,53.27 59.06,45.65 57.39,43.98 56.32,43.98 55.56,43.22 55.56,38.95 56.78,37.73 U$1.P$14
  Bottom 0.152: v31.94,40.93 32.55,40.32 32.55,39.71 IC1.16 | v25.99,37.58 24.93,37.58 23.86,38.64 23.86,43.37 22.95,44.28 22.95,47.94 25.08,50.07 v27.98,50.07
PB7  (via drill 0.35)
  Top 0.152: v29.5,44.74 29.5,45.04 24.93,49.62 v24.93,50.99
  Bottom 0.152: v29.5,44.74 33,41.23 33,39.71 IC1.17 | v24.93,50.99 36.66,50.99 41.08,46.57 50.53,46.57 56.78,40.32 U$1.P$15
PB8  (via drill 0.35)
  Top 0.152: v30.26,45.35 29.65,45.35 25.23,49.77 25.23,50.38 30.41,55.56 57.24,55.56 59.37,53.43 59.37,45.2 56.93,42.76 U$1.P$16
  Bottom 0.152: v30.26,45.35 30.26,44.43 33.46,41.23 33.46,39.71 IC1.18
PB12  (via drill 0.35)
  Top 0.152: v31.18,41.54 33.46,43.82 34.38,43.82 D2.A 34.53,43.98 35.29,44.74 36.66,44.74 37.73,43.67 37.73,42.3 41.08,38.95 42,38.95 42.91,38.03 42.91,37.88 49.16,31.63 49.16,13.04 56.78,5.42 56.78,4.66 U$1.P$1
  Bottom 0.152: v31.18,41.54 31.18,40.93 30.57,40.32 30.57,39.71 IC1.12
PB13  (via drill 0.35)
  Top 0.152: v25.99,40.93 27.52,40.93 32.85,46.26 34.38,46.26 D1.A 34.53,46.41 39.71,51.6 57.39,51.6 58.15,50.84 58.15,49.92 57.24,49.01 56.32,49.01 54.95,47.63 54.95,32.7 56.32,31.33 57.24,31.33 58.15,30.41 58.15,9.23 56.93,8.01 56.93,7.25 U$1.P$2
  Bottom 0.152: IC1.2 25.54,39.71 25.54,40.47 v25.99,40.93 25.99,44.28 26.76,45.04 26.76,45.81 R6.1
PB14  (via drill 0.35)
  Top 0.152: v34.53,54.19 v28.13,47.79
  Bottom 0.152: IC1.1 24.93,39.71 24.62,40.01 24.62,45.81 R4.1 24.62,45.96 25.38,45.96 26.15,46.72 27.36,46.72 28.13,47.48 v28.13,47.79 | v34.53,54.19 46.11,54.19 56.32,43.98 57.39,43.98 58.45,42.91 58.45,11.36 56.93,9.84 U$1.P$3
SH_A  (via drill 0.35)  (2 unrouted)
  Top 0.152: v26.91,30.11 25.08,30.11 24.62,30.57 v24.01,30.57
  Bottom 0.152: 26.91,30.26 27.67,31.02 27.82,31.02 27.98,31.18 27.98,31.94 IC1.42 | 26.91,30.26 26.6,29.96 26.6,29.04 C1.2 | v26.91,30.11 26.91,30.26 | v24.01,30.57 24.01,30.11 23.4,29.5 23.4,28.74 15.17,20.51 v10.75,20.51
SH_B  (via drill 0.35)  (1 unrouted)
  Top 0.152: v15.02,23.1 15.02,22.03 15.94,21.12 HB.2
  Top 3.556: HB.2 16.84,16.45 LB.3
  Bottom 0.152: C12.2 30.72,29.04 30.72,30.26 30.57,30.41 30.57,31.94 IC1.37 30.57,32.09 30.57,32.7 29.5,33.77 27.98,33.77 27.06,34.68 24.62,34.68 23.1,33.16 22.64,33.16 15.02,25.54 v15.02,23.1
SH_C  (via drill 0.35)  (2 unrouted)
  Top 0.152: v33,33.31 34.68,31.63 v34.68,30.11 34.68,29.5 v30.41,25.23
  Bottom 0.152: v34.68,30.11 34.83,29.96 34.83,29.04 C13.2 | v33,33.31 33,32.09 IC1.32 | v25.84,20.66 v30.41,25.23
SN1  (via drill 0.35)
  Top 0.381: v10.6,13.16 10.6,14.85 11.52,15.77 11.52,17.41 11.72,17.61 13.36,17.61 v13.8,18.05
  Bottom 0.152: C2.2 6.94,10.75 7.4,10.75 8.47,9.69 8.46,9.61 | 28.28,28.16 28.28,29.65 29.04,30.41 29.04,31.94 IC1.40
  Bottom 0.381: R1.2 10.62,13.14 v10.6,13.16 | v13.8,18.05 23.9,28.16 28.28,28.16 31.54,28.16 31.98,28.6 32,28.6 32.26,28.86 32.26,29.64 33.52,30.91 34.34,30.91 34.55,31.12 IC1.29
  other vias: 9.25,5.5 10.25,5.5 11.25,5.5 9.25,4.5 10.25,4.5 11.25,4.5 9.25,3.5 10.25,3.5 11.25,3.5
  pour Bottom: 8.46,9.61 8.46,2.91 12.53,2.91 12.53,9.61
  pour Top: 8.46,9.61 8.46,2.91 12.53,2.91 12.53,9.61
SN2  (via drill 0.35)
  Top 0.152: v31.18,33.31 31.79,33.92 33.31,33.92 35.44,31.79 v35.44,30.72
  Top 0.381: v18.3,13.16 18.3,14.36 19.14,15.19 19.14,17.41 19.34,17.61 21.56,17.61 v22,18.05
  Bottom 0.152: C3.2 14.56,10.75 15.02,10.75 16.09,9.69 16.08,9.61 | v31.18,33.31 31.48,33 31.48,32.09 IC1.35 | v35.44,30.72 35.55,30.72
  Bottom 0.381: R2.2 18.24,13.11 v18.3,13.16 | v22,18.05 31.57,27.62 35.01,27.62 35.74,28.36 35.74,29.64 35.55,29.84 35.55,30.72 IC1.27
  other vias: 17,5.5 18,5.5 19,5.5 17,4.5 18,4.5 19,4.5 17,3.5 18,3.5 19,3.5
  pour Top: 16.08,9.64 16.08,2.91 20.27,2.91 20.27,9.64
  pour Bottom: 16.08,9.61 16.08,2.91 20.27,2.91 20.27,9.61
VCC  (via drill 0.35)
  Top 0.152: v26.15,33.31 25.69,32.85 24.93,32.85 24.01,33.77 v24.01,35.59 | 23.55,40.32 23.55,44.43 v23.86,44.74 | 23.55,40.32 v23.55,36.97 | v32.85,45.35 32.39,45.35 27.36,40.32 23.55,40.32 | v37.12,42.6 37.12,40.32 41.08,36.36 42.15,36.36 42.91,35.59 42.91,11.82 41.69,10.6 41.69,9.84 U$1.P$23
  Bottom 0.152: 41.69,9.69 U$1.P$23 | 47.02,5.42 5V.TP-2 | R6.2 26.76,47.63 24.62,47.63 R4.2 24.47,47.48 23.71,46.72 23.71,45.2 23.86,45.04 v23.86,44.74 | v26.15,33.31 26.45,33 26.45,32.09 IC1.45 | v24.01,35.59 24.01,36.51 v23.55,36.97 | 35.51,41.32 32.85,43.98 v32.85,45.35 | v37.12,42.6 v37.12,42.61
  Bottom 0.28: IC1.20 34.61,39.62 34.61,40.42 35.51,41.32 36.79,42.61 v37.12,42.61 38.72,42.61
  Bottom 1.016: 41.69,9.69 42.76,9.69 47.02,5.42
VIN  (via drill 0.35)
  Top 0.152: 34.3,17.31 34.38,17.31 34.38,18.12
  Top 0.28: v35.92,42.68 36.7,41.9 v36.7,30.7
  Top 0.5: v36.7,30.7 34.3,28.3 34.3,17.31 34.3,6.1
  Top 1.5: C5.1 HA.3 | C7.1 HB.3 | C6.1 22.05,27 HC.3
  Top 3.048: TP1.TP 34.38,18.12 25.63,26.87 HC.3 HB.3 HA.3
  Bottom 0.28: C15.1 C14.1 36.4,43.16 v35.92,42.68
  Bottom 0.38: IC1.25 36.55,30.85 v36.7,30.7

### Text on the board
tPlace: 5V | GND
tNames: NFault | Enable | BLDC / Driver | V3 | High Side | GND | Low Side